# EAGLE schematic Test Eagle File Sch (EAGLE 9.2.2)

## Sheet 1 of 2
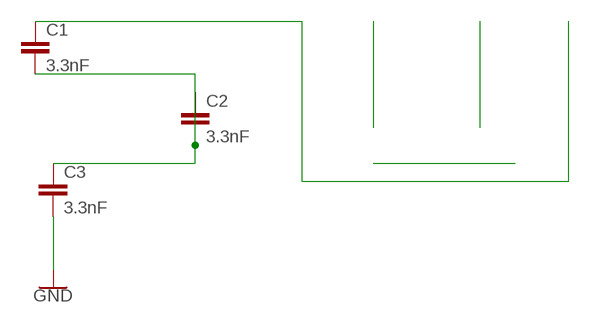
[diagram p0: schematic, sheet 1]

### Parts
C1  3.3nF  3.3NF-0603-100V-10%  [0603]
C2  3.3nF  3.3NF-0603-100V-10%  [0603]
C3  3.3nF  3.3NF-0603-100V-10%  [0603]

### Nets
GND: C3.2 ; also sheet 2
N$1: C1.2 C2.2 C3.1
N$3: C1.1
Unconnected: C2.1

## Sheet 2 of 2
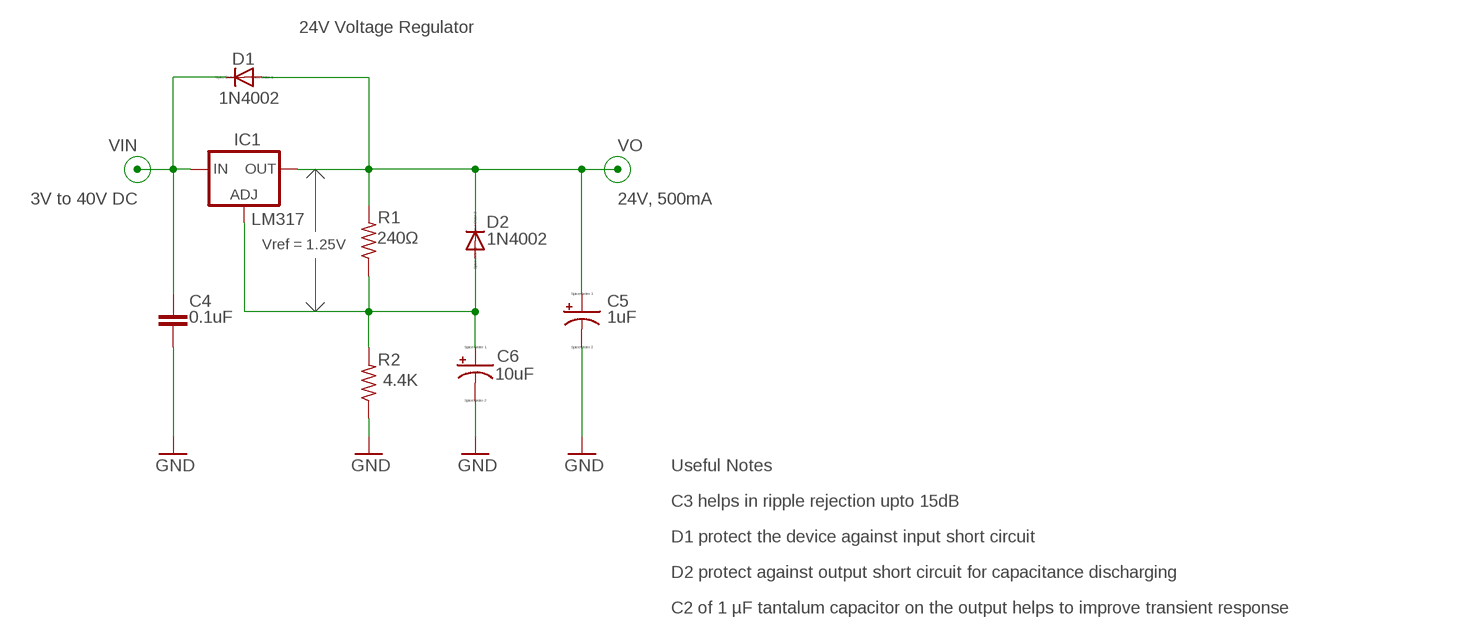
[diagram p1: schematic, sheet 2]

### Parts
C4  0.1uF  C-EU075-052X106  [C075-052X106]
C5  1uF  CPOL-US085CS-1AR  [085CS_1AR]
C6  10uF  CPOL-US085CS-1AR  [085CS_1AR]
D1  1N4002  1N4004  [DO41-10]
D2  1N4002  1N4004  [DO41-10]
IC1  LM317MBSTT3  [SOT223]
R1  240Ω  R-US_M0805  [M0805]
R2  4.4K  R-US_M0805  [M0805]

### Nets
GND: C4.2 C5.- C6.- R2.1 ; also sheet 1
N$2: C6.+ D2.A IC1.1(ADJ) R1.1 R2.2
VIN: C4.1 D1.C IC1.3(IN)
VO: C5.+ D1.A D2.C IC1.4(OUT) R1.2

### Notes on the sheet
- 24V Voltage Regulator
- 3V to 40V DC | 24V, 500mA
- Vref = 1.25V
- Useful Notes
- C3 helps in ripple rejection upto 15dB
- D1 protect the device against input short circuit
- D2 protect against output short circuit for capacitance discharging
- C2 of 1 µF tantalum capacitor on the output helps to improve transient response

## Library data of the parts
C1-C3 = SparkFun-Capacitors:3.3NF: 3.3nF ceramic capacitors A capacitor is a passive two-terminal electrical component used to store electrical energy temporarily in an electric field.; PROD_ID: CAP-09633
C4 = rcl:C-EU: CAPACITOR, European symbol
C5 C6 = resistor:CPOL-US: POLARIZED CAPACITOR, American symbol
D1 D2 = diode:1N4004: DIODE general purpose rectifier, 1 A
IC1 = v-reg:LM317?*: 500 mA Adjustable Output Positive Voltage Regulator Source: http://www.onsemi.co.jp .. LM317M-D.PDF; PARTNUMBER: LM317
R1 R2 = resistor:R-US_: RESISTOR, American symbol